# EAGLE schematic TRV_ANAREN_V0.4 (EAGLE 6.3)
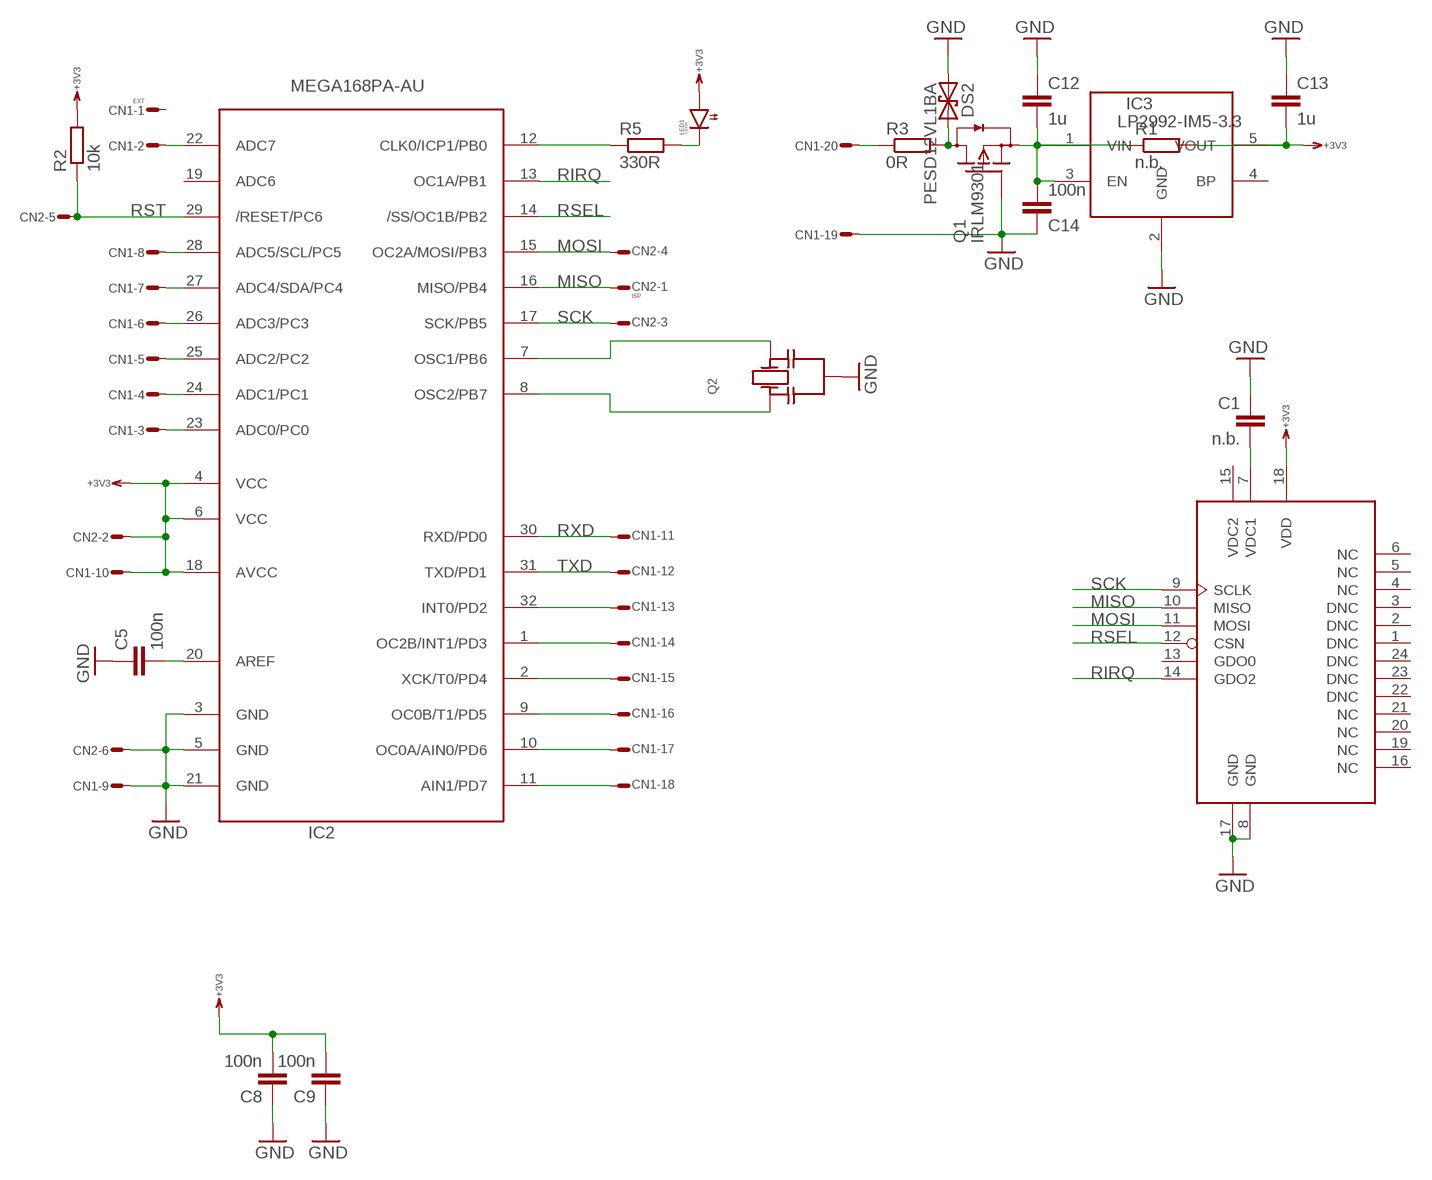
[diagram p0: schematic, sheet 1]

## Parts
C1  n.b.  C0603  [0603]
C5  100n  C0603  [0603]
C8  100n  C0603  [0603]
C9  100n  C0603  [0603]
C12  1u  C0603  [0603]
C13  1u  C0603  [0603]
C14  100n  C0603  [0603]
CN1  EXT  ML20E  [ML20]
CN2  ISP  ML6E  [ML6]
DS2  PESD12VL1BA  TVS-U323  [SOD323]
IC2  MEGA168PA-AU  MEGA168PA  [TQFP32-08]
IC3  LP2992-IM5-3.3  LDO  [SOT23-5]
LED1  LEDR  LED0603  [0603]
Q1  IRLM9301  FET-PDSOT23  [SOT23]
Q2  QRCR  [CR]
R1  n.b.  R0603  [0603]
R2  10k  R0603  [0603]
R3  0R  R0603  [0603]
R5  330R  R0603  [0603]
RF1  ANARENC  [ANAREN_C]

## Nets
+3V3: C8.2 C9.2 C13.2 CN1.10 CN2.2 IC2.4(VCC) IC2.6(VCC) IC2.18(AVCC) IC3.5(VOUT) LED1.1(A) R1.2 R2.2 RF1.18(VDD)
GND: C1.1 C5.1 C8.1 C9.1 C12.1 C13.1 C14.1 CN1.9 CN1.19 CN2.6 DS2.A IC2.3(GND) IC2.5(GND) IC2.21(GND) IC3.2(GND) Q1.1(G) Q2.M RF1.8(GND) RF1.17(GND)
MISO: CN2.1 IC2.16(MISO/PB4) RF1.10(MISO)
MOSI: CN2.4 IC2.15(OC2A/MOSI/PB3) RF1.11(MOSI)
N$1: C1.2 RF1.7(VDC1)
N$2: IC2.12(CLK0/ICP1/PB0) R5.1
N$3: CN1.2 IC2.22(ADC7)
N$5: DS2.C Q1.3(D) R3.2
N$6: C5.2 IC2.20(AREF)
N$12: C12.2 C14.2 IC3.1(VIN) IC3.3(EN) Q1.2(S) R1.1
N$18: IC2.7(OSC1/PB6) Q2.2
N$19: IC2.8(OSC2/PB7) Q2.1
N$21: LED1.2(C) R5.2
PC0: CN1.3 IC2.23(ADC0/PC0)
PC1: CN1.4 IC2.24(ADC1/PC1)
PC2: CN1.5 IC2.25(ADC2/PC2)
PC3: CN1.6 IC2.26(ADC3/PC3)
PC4: CN1.7 IC2.27(ADC4/SDA/PC4)
PC5: CN1.8 IC2.28(ADC5/SCL/PC5)
PD2: CN1.13 IC2.32(INT0/PD2)
PD3: CN1.14 IC2.1(OC2B/INT1/PD3)
PD4: CN1.15 IC2.2(XCK/T0/PD4)
PD5: CN1.16 IC2.9(OC0B/T1/PD5)
PD6: CN1.17 IC2.10(OC0A/AIN0/PD6)
PD7: CN1.18 IC2.11(AIN1/PD7)
RIRQ: IC2.13(OC1A/PB1) RF1.14(GDO2)
RSEL: IC2.14(/SS/OC1B/PB2) RF1.12(CSN)
RST: CN2.5 IC2.29(/RESET/PC6) R2.1
RXD: CN1.11 IC2.30(RXD/PD0)
SCK: CN2.3 IC2.17(SCK/PB5) RF1.9(SCLK)
TXD: CN1.12 IC2.31(TXD/PD1)
VIN: CN1.20 R3.1
Unconnected: CN1.1 IC2.19(ADC6) IC3.4(BP) RF1.1(DNC) RF1.2(DNC) RF1.3(DNC) RF1.4(NC) RF1.5(NC) RF1.6(NC) RF1.13(GDO0) RF1.15(VDC2) RF1.16(NC) RF1.19(NC) RF1.20(NC) RF1.21(NC) RF1.22(DNC) RF1.23(DNC) RF1.24(DNC)

## Library data of the parts
C1 C5 C8 C9 C12-C14 = RCL:C: Capacitor SMD
CN1 = Conn:ML20?E: HARTING
CN2 = Conn:ML6E: HARTING
DS2 = Diode:TVS-U: DIODE
IC2 = atmel:MEGA168P: MCU, 4/8/16k, TQFP32
IC3 = DCDC:LDO
LED1 = Optic:LED
Q1 = Transistor:FET-PD
Q2 = QUARTZ:QR
R1-R3 R5 = RCL:R: Resistor SMD
RF1 = RF:ANAREN